# Altium project smallBoard.PrjPCB
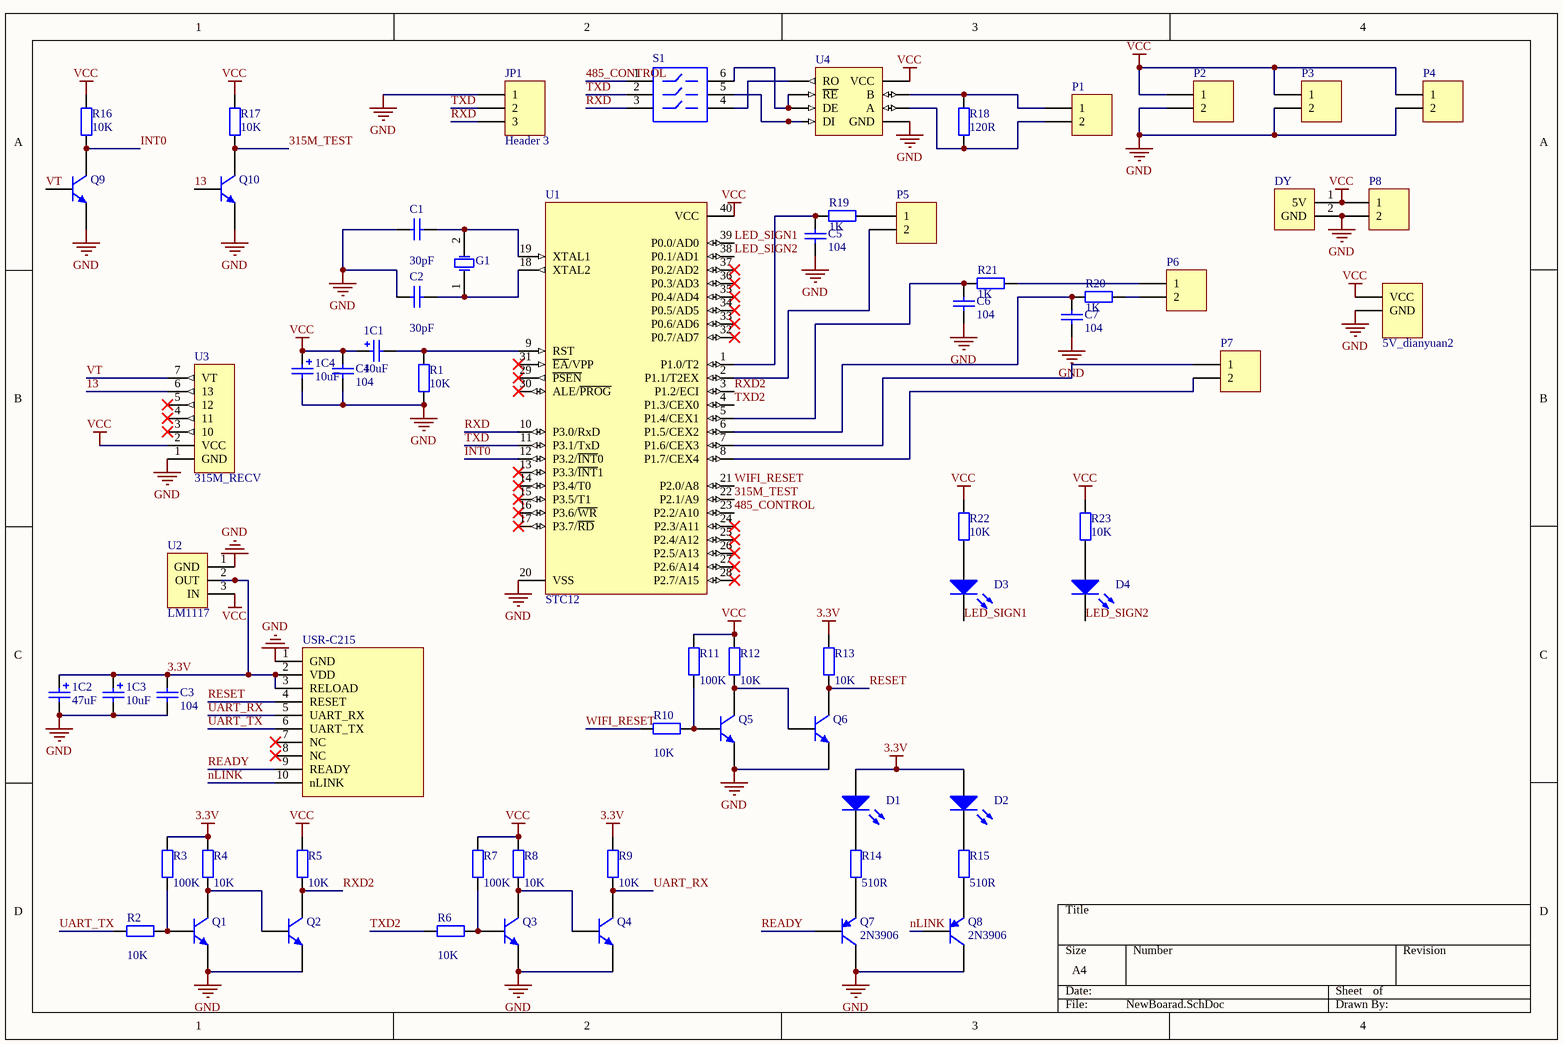
[diagram p0: NewBoarad.SchDoc]
1 sheet, 66 parts. Net scope: global (net labels, ports and power ports of the same name join across sheets).

## Sheet NewBoarad.SchDoc
size A4

### Parts
1C1  value 10uF  [CAPPR5-5X5]  (hidden comment: Cap Pol1)
1C2  value 47uF  [CAPPR5-5X5]  (hidden comment: Cap Pol1)
1C3  value 10uF  [CAPPR5-5X5]  (hidden comment: Cap Pol1)
1C4  value 10uF  [CAPPR5-5X5]  (hidden comment: Cap Pol1)
5V_dianyuan2  5V_dianyuan2  [5v_dianyuan2]  (value not drawn)
C1  30pF  [CAPR5.08-7.8X3.2]
C2  value 30pF  [CAPR5.08-7.8X3.2]  (hidden comment: 104)
C3  104  [CAPR5.08-7.8X3.2]
C4  104  [CAPR5.08-7.8X3.2]
C5  104  [CAPR5.08-7.8X3.2]
C6  104  [CAPR5.08-7.8X3.2]
C7  104  [CAPR5.08-7.8X3.2]
D1  LED0  [LED-0]  (value not drawn)
D2  LED0  [LED-0]  (value not drawn)
D3  LED0  [LED-0]  (value not drawn)
D4  LED0  [LED-0]  (value not drawn)
DY  5V_yuankong  [5V_yuankong]  (value not drawn)
G1  XTAL  [CAPR5.08-7.8X3.2]  (value not drawn)
JP1  Header 3  [HDR1X3]
P1  duanzi-2  [duanzi-2]  (value not drawn)
P2  duanzi-2  [duanzi-2]  (value not drawn)
P3  duanzi-2  [duanzi-2]  (value not drawn)
P4  duanzi-2  [duanzi-2]  (value not drawn)
P5  duanzi-2  [duanzi-2]  (value not drawn)
P6  duanzi-2  [duanzi-2]  (value not drawn)
P7  duanzi-2  [duanzi-2]  (value not drawn)
P8  duanzi-2  [duanzi-2]  (value not drawn)
Q1  2N3904  [TO-92A]  (value not drawn)
Q2  2N3904  [TO-92A]  (value not drawn)
Q3  2N3904  [TO-92A]  (value not drawn)
Q4  2N3904  [TO-92A]  (value not drawn)
Q5  2N3904  [TO-92A]  (value not drawn)
Q6  2N3904  [TO-92A]  (value not drawn)
Q7  2N3906  [TO-92A]
Q8  2N3906  [TO-92A]
Q9  2N3904  [TO-92A]  (value not drawn)
Q10  2N3904  [TO-92A]  (value not drawn)
R1  10K  [AXIAL-0.3]
R2  value 10K  [AXIAL-0.3]  (hidden comment: 1K)
R3  value 100K  [AXIAL-0.3]  (hidden comment: 1K)
R4  value 10K  [AXIAL-0.3]  (hidden comment: 1K)
R5  value 10K  [AXIAL-0.3]  (hidden comment: 1K)
R6  value 10K  [AXIAL-0.3]  (hidden comment: 1K)
R7  value 100K  [AXIAL-0.3]  (hidden comment: 1K)
R8  value 10K  [AXIAL-0.3]  (hidden comment: 1K)
R9  value 10K  [AXIAL-0.3]  (hidden comment: 1K)
R10  value 10K  [AXIAL-0.3]  (hidden comment: 1K)
R11  value 100K  [AXIAL-0.3]  (hidden comment: 1K)
R12  value 10K  [AXIAL-0.3]  (hidden comment: 1K)
R13  value 10K  [AXIAL-0.3]  (hidden comment: 1K)
R14  value 510R  [AXIAL-0.3]  (hidden comment: 1K)
R15  value 510R  [AXIAL-0.3]  (hidden comment: 1K)
R16  10K  [AXIAL-0.3]
R17  10K  [AXIAL-0.3]
R18  120R  [AXIAL-0.3]
R19  1K  [AXIAL-0.3]
R20  1K  [AXIAL-0.3]
R21  1K  [AXIAL-0.3]
R22  10K  [AXIAL-0.3]
R23  10K  [AXIAL-0.3]
S1  boma-3  [boma-3]  (value not drawn)
U1  STC12  [SOT129-1]
U2  LM1117  [LM1117]
U3  315M_RECV  [315M_RECV]
U4  485_test  [485_test]  (value not drawn)
USR-C215  USR-C215  [DIP2.0*1-10-M]  (value not drawn)

### Nets
3.3V: 1C2.1 1C3.1 C3.1 D1.1(A) D2.1(A) R3.1 R4.1 R9.1 R13.1 U2.2(OUT) USR-C215.2(VDD) USR-C215.3(RELOAD)
GND: 1C2.2 1C3.2 1C4.2 5V_dianyuan2.2(GND) C1.1 C2.1 C3.2 C4.2 C5.2 C6.2 C7.2 DY.2(GND) JP1.1 P2.2 P3.2 P4.2 P8.2 Q1.1(E) Q2.1(E) Q3.1(E) Q4.1(E) Q5.1(E) Q6.1(E) Q7.3(C) Q8.3(C) Q9.1(E) Q10.1(E) R1.2 U1.20(VSS) U2.1(GND) U3.1(GND) U3.12(GND) U4.5(GND) USR-C215.1(GND)
VCC: 1C1.1 1C4.1 5V_dianyuan2.1(VCC) C4.1 DY.1(5V) P2.1 P3.1 P4.1 P8.1 R5.1 R7.1 R8.1 R11.1 R12.1 R16.1 R17.1 R22.1 R23.1 U1.40(VCC) U2.3(IN) U3.2(VCC) U3.13(VCC) U4.8(VCC)
13: Q10.2(B) U3.6(13)
315M_TEST: Q10.3(C) R17.2 U1.22(P2.1/A9)
485_CONTROL: S1.1 U1.23(P2.2/A10)
INT0: Q9.3(C) R16.2 U1.12(P3.2/~{INT}0)
LED_SIGN1: D3.2(K) U1.39(P0.0/AD0)
LED_SIGN2: D4.2(K) U1.38(P0.1/AD1)
nLINK: Q8.2(B) USR-C215.10(nLINK)
READY: Q7.2(B) USR-C215.9(READY)
RESET: Q6.3(C) R13.2 USR-C215.4(RESET)
RXD: JP1.3 S1.3 U1.10(P3.0/RxD)
RXD2: Q2.3(C) R5.2 U1.3(P1.2/ECI)
TXD: JP1.2 S1.2 U1.11(P3.1/TxD)
TXD2: R6.1 U1.4(P1.3/CEX0)
UART_RX: Q4.3(C) R9.2 USR-C215.5(UART_RX)
UART_TX: R2.1 USR-C215.6(UART_TX)
VT: Q9.2(B) U3.7(VT)
WIFI_RESET: R10.1 U1.21(P2.0/A8)
Net1C1_2: 1C1.2 R1.1 U1.9(RST)
NetC1_2: C1.2 G1.2(OSC2) U1.19(XTAL1)
NetC2_2: C2.2 G1.1(OSC1) U1.18(XTAL2)
NetC5_1: C5.1 R19.1 U1.1(P1.0/T2)
NetC6_1: C6.1 R21.1 U1.5(P1.4/CEX1)
NetC7_1: C7.1 R20.1 U1.6(P1.5/CEX2)
NetD1_2: D1.2(K) R14.1
NetD2_2: D2.2(K) R15.1
NetD3_1: D3.1(A) R22.2
NetD4_1: D4.1(A) R23.2
NetP1_1: P1.1 R18.1 U4.7(B)
NetP1_2: P1.2 R18.2 U4.6(A)
NetP5_1: P5.1 R19.2
NetP5_2: P5.2 U1.2(P1.1/T2EX)
NetP6_1: P6.1 R21.2
NetP6_2: P6.2 R20.2
NetP7_1: P7.1 U1.7(P1.6/CEX3)
NetP7_2: P7.2 U1.8(P1.7/CEX4)
NetQ1_2: Q1.2(B) R2.2 R3.2
NetQ1_3: Q1.3(C) Q2.2(B) R4.2
NetQ3_2: Q3.2(B) R6.2 R7.2
NetQ3_3: Q3.3(C) Q4.2(B) R8.2
NetQ5_2: Q5.2(B) R10.2 R11.2
NetQ5_3: Q5.3(C) Q6.2(B) R12.2
NetQ7_1: Q7.1(E) R14.2
NetQ8_1: Q8.1(E) R15.2
NetS1_4: S1.4 U4.1(RO)
NetS1_5: S1.5 U4.4(DI)
NetS1_6: S1.6 U4.2(~{RE}) U4.3(DE)

Not connected (* = marked no-connect by the designer): U1 13(P3.3/~{INT}1)* 14(P3.4/T0)* 15(P3.5/T1)* 16(P3.6/~{WR})* 17(P3.7/~{RD})* 24(P2.3/A11)* 25(P2.4/A12)* 26(P2.5/A13)* 27(P2.6/A14)* 28(P2.7/A15)* 29(~{PSEN})* 30(ALE/~{PROG})* 31(~{EA}/VPP)* 32(P0.7/AD7)* 33(P0.6/AD6)* 34(P0.5/AD5)* 35(P0.4/AD4)* 36(P0.3/AD3)* 37(P0.2/AD2)*; U3 3(10)* 4(11)* 5(12)*; USR-C215 7(NC)* 8(NC)*

### Library data of the parts
1C1-1C4 = Cap Pol1: Polarized Capacitor (Radial); Published: 8-Jun-2000; Revision: July-2002: Re-released for DXP Platform.; Publisher: Altium Limited
C1-C7 = Cap: Capacitor; Published: 8-Jun-2000; Revision: July-2002: Re-released for DXP Platform.; Publisher: Altium Limited
  C1: Value: 30pF
  C3-C7: Value: 104
D1-D4 = LED0: Typical INFRARED GaAs LED; Published: 8-Jun-2000; LatestRevisionDate: 08-Jul-2005; LatestRevisionNote: Mech Layer 1 removed.; PackageReference: LED-0; Publisher: Altium Limited
G1 = XTAL: Crystal Oscillator; Published: 8-Jun-2000; Revision: July-2002: Re-released for DXP Platform.; Publisher: Altium Limited
JP1 = Header 3: Header, 3-Pin; Revision: 17-Jul-2002: Re-released for DXP Platform.; Publisher: Altium Limited
P1-P8 = duanzi-2: Header, 2-Pin; LatestRevisionDate: 17-Jul-2002; LatestRevisionNote: Re-released for DXP Platform.; Publisher: Altium Limited
Q1-Q6 Q9 Q10 = 2N3904: NPN General Purpose Amplifier; Published: 8-Jun-2000; LatestRevisionDate: 15-Jan-2003; LatestRevisionNote: PCB Footprint 'BCY-W3/D4.7' replaced; DatasheetDocument: 1997; PackageDocument: Sep-1998; PackageReference: TO-92A; Publisher: Altium Limited; Code_JEDEC: TO-92A; ComponentLink1Description: Manufacturer Link; ComponentLink1URL: http://www.fairchildsemi.com/; ComponentLink2Description: Datasheet; ComponentLink2URL: http://www.fairchildsemi.com/ds/2N%2F2N3904.pdf
Q7 Q8 = 2N3906: PNP General Purpose Amplifier; Published: 8-Jun-2000; LatestRevisionDate: 15-Jan-2003; LatestRevisionNote: PCB Footprint 'BCY-W3/D4.7' replaced; DatasheetDocument: 1997; PackageDocument: Sep-1998; PackageReference: TO-92A; Publisher: Altium Limited; Code_JEDEC: TO-92A; ComponentLink1Description: Manufacturer Link; ComponentLink1URL: http://www.fairchildsemi.com/; ComponentLink2Description: Datasheet; ComponentLink2URL: http://www.fairchildsemi.com/ds/2N%2F2N3906.pdf
R1-R17 R19-R21 = Res2: Resistor; Published: 8-Jun-2000; Revision: July-2002: Re-released for DXP Platform.; Publisher: Altium Limited
  R1 R16 R17: Value: 10k
  R19-R21: Value: 1K
R18 = Res2: Resistor; Value: 10k; Published: 8-Jun-2000; Revision: July-2002: Re-released for DXP Platform.; Publisher: Altium Limited
R22 R23 = Res2: Resistor; Value: 1K; Published: 8-Jun-2000; Revision: July-2002: Re-released for DXP Platform.; Publisher: Altium Limited
S1 = boma-3: DIP Switch; Published: 24-Mar-1999; LatestRevisionDate: 17-Jul-2002; LatestRevisionNote: Re-released for DXP Platform.; PackageReference: DIP-8; Publisher: Altium Limited
U1 = P89C51RD2BN/01: 80C51 8-Bit Flash Microcontroller Family, 64 kB ISP/IAP Flash with 1 kB RAM.; Package Information: Latest Revision: Aug-2000; Code - JEDEC: MO-015; Published: 21-May-2003; Datasheet: Latest Revision: 18-Jul-2002; Package Reference: SOT129-1; Publisher: Altium Limited
U4 = 485_test: Header, 4-Pin, Dual row; LatestRevisionDate: 17-Jul-2002; LatestRevisionNote: Re-released for DXP Platform.; Publisher: Altium Limited
U3 = 315M_RECV: Published: 8-Jun-2000; LatestRevisionDate: 16-Dec-2005; LatestRevisionNote: Hidden power pin's "Connect To" field completed.; PackageDocument: Mar-2002; PackageReference: SOT402-1; Publisher: Altium Limited; Code_JEDEC: MO-153-AB-1
USR-C215 = USR-C215: LatestRevisionDate: *; LatestRevisionNote: *; Publisher: *